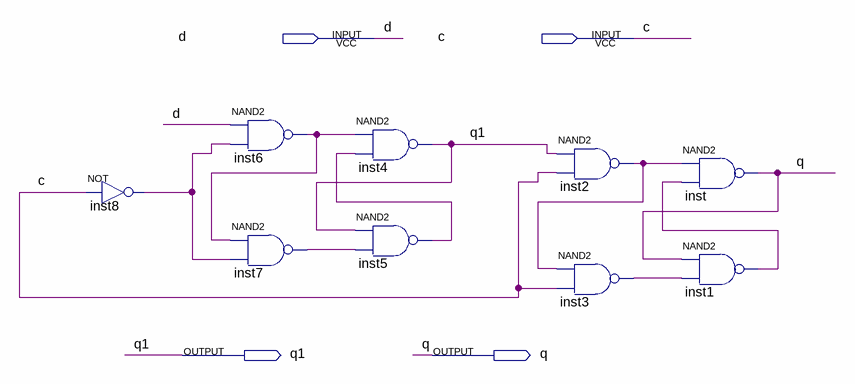
[diagram p0: schematic sheet]
// Quartus schematic s54_2st.bdf as structural Verilog: 9 symbols, 4 pins
module s54_2st (
  input  d,
  input  c,
  output q1,
  output q
);

  wire inst1_out, inst2_out, inst3_out, inst5_out, inst6_out, inst7_out, inst8_out;

  not inst8 (inst8_out, c);
  nand inst6 (inst6_out, d, inst8_out);
  nand inst7 (inst7_out, inst6_out, inst8_out);
  nand inst4 (q1, inst6_out, inst5_out);
  nand inst5 (inst5_out, q1, inst7_out);
  nand inst2 (inst2_out, q1, c);
  nand inst3 (inst3_out, inst2_out, c);
  nand inst (q, inst2_out, inst1_out);
  nand inst1 (inst1_out, q, inst3_out);
endmodule
